# EAGLE design phone_charger (EAGLE 5.11)
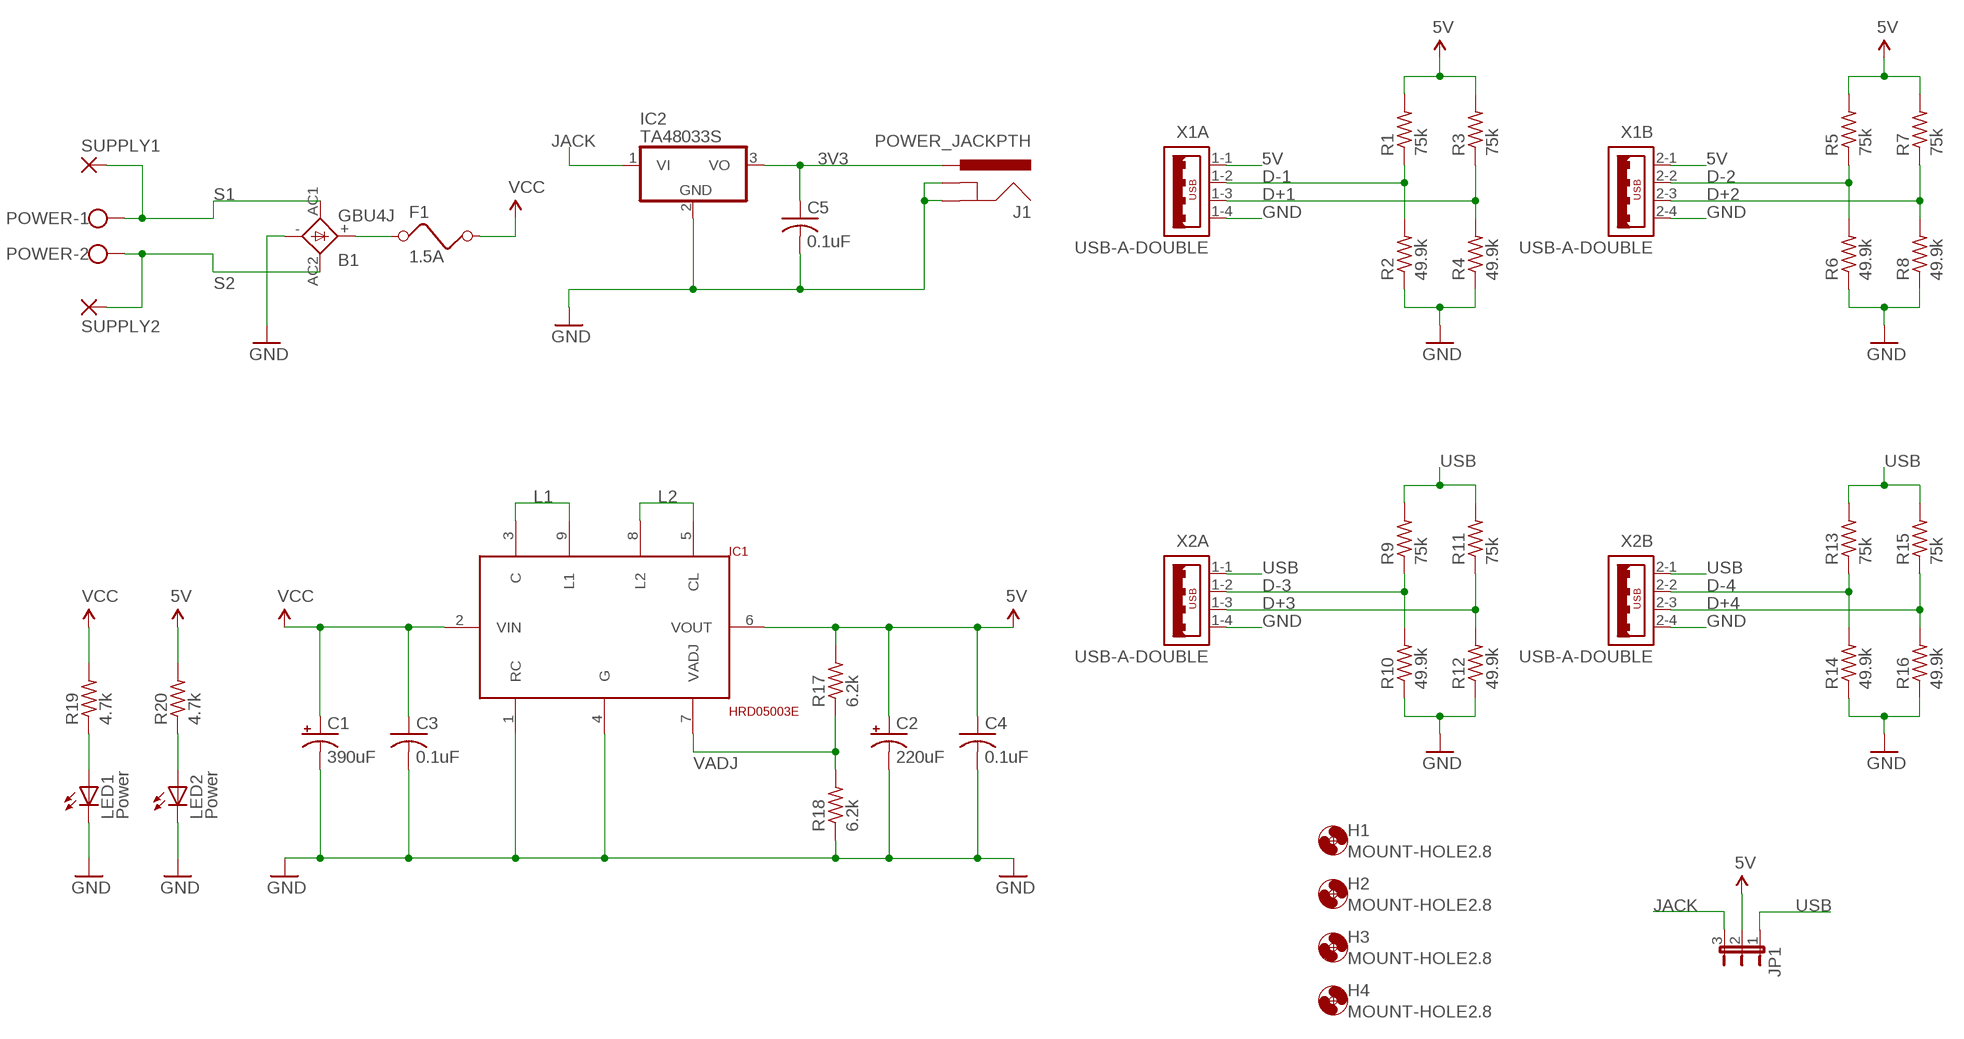
[diagram p0: schematic, sheet 1]

## Parts
B1  GBU4J  GBU4  [GBU4S]
C1  390uF  CPOL-USE3.5-8  [E3,5-8]
C2  220uF  CPOL-USE3.5-8  [E3,5-8]
C3  0.1uF  C-US025-030X050  [C025-030X050]
C4  0.1uF  C-US025-030X050  [C025-030X050]
C5  0.1uF  C-US025-030X050  [C025-030X050]
F1  1.5A  FUSE  [FUSE]
H1  MOUNT-HOLE2.8  [2,8]
H2  MOUNT-HOLE2.8  [2,8]
H3  MOUNT-HOLE2.8  [2,8]
H4  MOUNT-HOLE2.8  [2,8]
IC1  HRD05003E  [CONV-PACK]
IC2  TA48033S  788TV  [TO220V]
J1  POWER_JACKPTH  [POWER_JACK_PTH]
JP1  JP2E  [JP2]
LED1  Power  LED5MM  [LED5MM]
LED2  Power  LED5MM  [LED5MM]
POWER  W237-102  [W237-102]
R1  75k  R-US_0207/10  [0207/10]
R2  49.9k  R-US_0207/10  [0207/10]
R3  75k  R-US_0207/10  [0207/10]
R4  49.9k  R-US_0207/10  [0207/10]
R5  75k  R-US_0207/10  [0207/10]
R6  49.9k  R-US_0207/10  [0207/10]
R7  75k  R-US_0207/10  [0207/10]
R8  49.9k  R-US_0207/10  [0207/10]
R9  75k  R-US_0207/10  [0207/10]
R10  49.9k  R-US_0207/10  [0207/10]
R11  75k  R-US_0207/10  [0207/10]
R12  49.9k  R-US_0207/10  [0207/10]
R13  75k  R-US_0207/10  [0207/10]
R14  49.9k  R-US_0207/10  [0207/10]
R15  75k  R-US_0207/10  [0207/10]
R16  49.9k  R-US_0207/10  [0207/10]
R17  6.2k  R-US_0207/10  [0207/10]
R18  6.2k  R-US_0207/10  [0207/10]
R19  4.7k  R-US_0207/10  [0207/10]
R20  4.7k  R-US_0207/10  [0207/10]
SUPPLY1  3,81/1,4  [3,81/1,4]
SUPPLY2  3,81/1,4  [3,81/1,4]
X1  USB-A-DOUBLE  [USB-A-DOUBLE]
X2  USB-A-DOUBLE  [USB-A-DOUBLE]

## Nets
3V3: C5.1 IC2.3(VO) J1.PWR
5V: C2.+ C4.1 IC1.6(VOUT) JP1.2 R1.2 R3.2 R5.2 R7.2 R17.2 R20.2 X1.1-1 X1.2-1
D+1: R3.1 R4.2 X1.1-3
D+2: R7.1 R8.2 X1.2-3
D+3: R11.1 R12.2 X2.1-3
D+4: R15.1 R16.2 X2.2-3
D-1: R1.1 R2.2 X1.1-2
D-2: R5.1 R6.2 X1.2-2
D-3: R9.1 R10.2 X2.1-2
D-4: R13.1 R14.2 X2.2-2
GND: B1.- C1.- C2.- C3.2 C4.2 C5.2 IC1.1(RC) IC1.4(G) IC2.2(GND) J1.GND J1.GNDBREAK LED1.K(C) LED2.K(C) R2.1 R4.1 R6.1 R8.1 R10.1 R12.1 R14.1 R16.1 R18.1 X1.1-4 X1.2-4 X2.1-4 X2.2-4
JACK: IC2.1(VI) JP1.3
L1: IC1.3(C) IC1.9(L1)
L2: IC1.5(CL) IC1.8(L2)
N$1: LED1.A R19.1
N$2: LED2.A R20.1
N$3: B1.+ F1.1
S1: B1.AC1(AC2) POWER.1 SUPPLY1.1(P)
S2: B1.AC2(AC1) POWER.2 SUPPLY2.1(P)
USB: JP1.1 R9.2 R11.2 R13.2 R15.2 X2.1-1 X2.2-1
VADJ: IC1.7(VADJ) R17.1 R18.2
VCC: C1.+ C3.1 F1.2 IC1.2(VIN) R19.2

## Library data of the parts
B1 = rectifier:GBU4: GENERAL INSTRUMENT RECTIFIER
C1 C2 = rcl:CPOL-US: POLARIZED CAPACITOR, American symbol
C3-C5 = rcl:C-US: CAPACITOR, American symbol
F1 = special:FUSE: FUSE 5 x 20 mm
H1-H4 = holes:MOUNT-HOLE: MOUNTING HOLE with drill center marker
IC1 = tayken:HRD05003E
IC2 = linear:78*: Positive VOLTAGE REGULATOR Source: http://cache.national.com/ds/LM/LM78L05.pdf http://www.fairchildsemi.com/ds/LM/LM7805.pdf
J1 = SparkFun:POWER_JACK: Power Jack This is the standard 5.5mm barrel jack for power. The PTH is the most common, proven, reliable, footprint. All others are experimental. The Slot footprint only works if the mill layer is transmitted to the PCB fab house so be warned. Spark Fun Electronics SKU : PRT-00119. Mating wall wart : TOL-00298 (and others)
JP1 = jumper:JP2E: JUMPER
LED1 LED2 = SparkFun:LED: LEDs Standard schematic elements and footprints for 5mm, 3mm, 1206, and 0603 sized LEDs. 5mm - Spark Fun Electronics SKU : COM-00529 (and others)
POWER = con-wago-500:W237-102: WAGO SCREW CLAMP; MPN: 237-102; OC_FARNELL: unknown; OC_NEWARK: 70K9898
R1-R20 = resistor:R-US_: RESISTOR, American symbol
SUPPLY1 SUPPLY2 = wirepad:3,81/1,4: THROUGH-HOLE PAD
X1 X2 = tayken:USB-A-DOUBLE

## Board
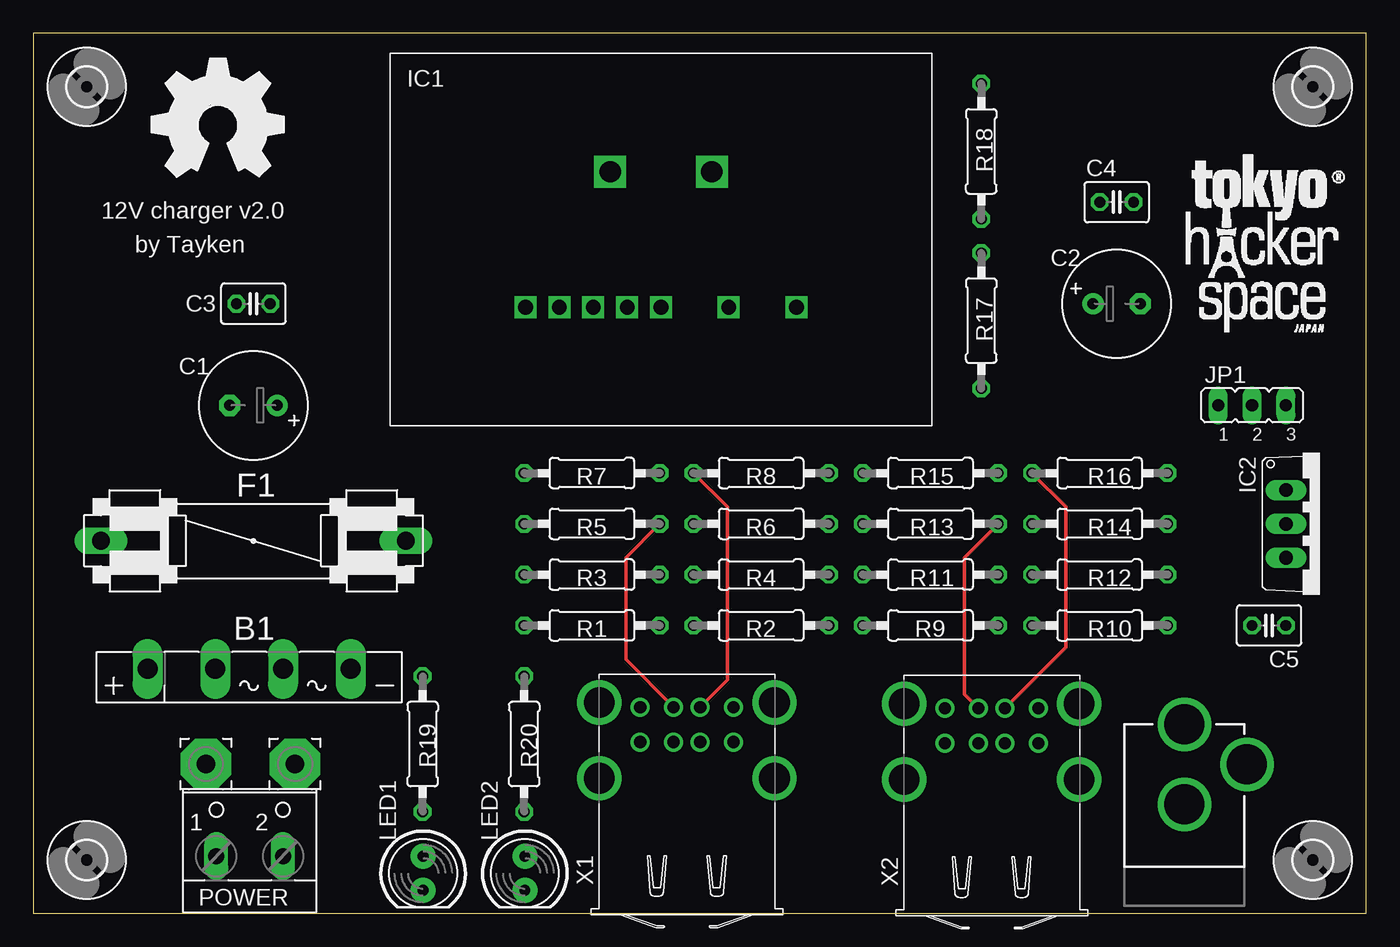
[diagram p1: board, top side]
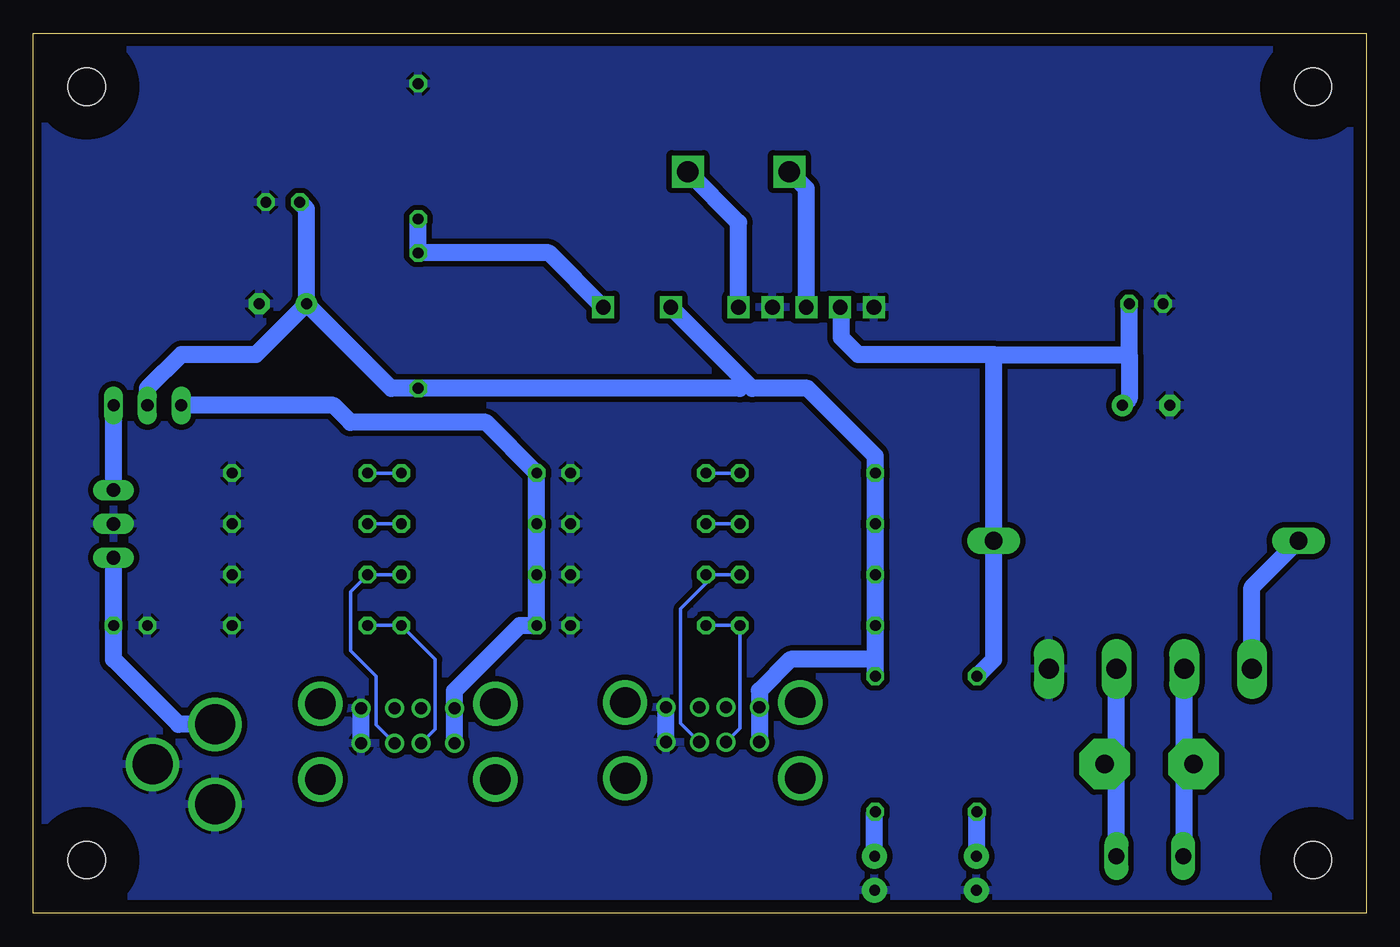
[diagram p2: board, bottom side, seen from below]

Size 100 x 66 mm. Coordinates in mm from the lower left corner, seen from the top.
Outline: 0,0 100,0 100,66 0,66 0,0
Copper layers (1*16): Top 0.035mm / dielectric 1.5mm / Bottom 0.035mm
Design rules "Fusion_eagle_rule_v1.1": minimum track width 6mil, minimum drill 12mil, track to track 6mil, track to pad 6mil, pad to pad 6mil, via to via 6mil, smd to smd 0mil, copper to edge 10mil, drill to drill 10mil, minimum pad ring 10mil, minimum via ring 6mil, stop-mask expansion 2mil, vias tented up to drill 100mil, thermal gap 10mil

### Footprints (pad centres in the part's own frame; a part is rotated, then mirrored left to right if it is on the bottom)
GBU4S = drill 1.499 long: + 7.62,0; - -7.62,0; AC1 2.54,0; AC2 -2.54,0
E3,5-8 = drill 0.813 pad 1.6 round: + -1.778,0 | drill 0.813 pad 1.6 octagon: - 1.778,0
C025-030X050 = drill 0.813 octagon: 1 -1.27,0; 2 1.27,0
FUSE = drill 1.321 long: 1 -11.43,0; 2 11.43,0
2,8 = hole 2.8: 0,0
CONV-PACK = drill 1.1 square: 1 -10.16,-5.08; 2 -7.62,-5.08; 3 -5.08,-5.08; 4 -2.54,-5.08; 5 0,-5.08; 6 5.08,-5.08; 7 10.16,-5.08 | drill 1.6 square: 8 3.81,5.08; 9 -3.81,5.08
TO220V = drill 1.016 long: 1 -2.54,-2.54; 2 0,-2.54; 3 2.54,-2.54
POWER_JACK_PTH = drill 2.997 round: GND 0,7.7; GNDBREAK 4.7,10.7; PWR 0,13.7
JP2 = drill 0.914 long: 1 -2.54,0; 2 0,0; 3 2.54,0
LED5MM = drill 0.813 pad 1.88 round: A -1.27,0; K 1.27,0
W237-102 = drill 1.194 long: 1 -2.5,-1.27; 2 2.5,-1.27
0207/10 = drill 0.813 octagon: 1 -5.08,0; 2 5.08,0
3,81/1,4 = drill 1.397 pad 3.81 octagon: 1 0,0
USB-A-DOUBLE = drill 0.92 pad 1.27 round: 1-1 1.44,3.5; 1-2 1.44,1; 1-3 1.44,-1; 1-4 1.44,-3.5; 2-1 4.06,3.5; 2-2 4.06,1; 2-3 4.06,-1; 2-4 4.06,-3.5 | drill 2.3 pad 3 round: M1 -1.27,6.57; M2 -1.27,-6.57; M3 4.41,6.57; M4 4.41,-6.57

### Placement (x,y rotation side)
B1  16.2,18.34 180 top
C1  16.51,38.1 180 top
C2  81.28,45.72 0 top
C3  16.51,45.72 180 top
C4  81.28,53.34 0 top
C5  92.71,21.59 180 top
F1  16.51,27.94 0 top
H1  4,4 0 top
H2  96,4 0 top
H3  96,62 0 top
H4  4,62 0 top
IC1  47.09,50.54 0 top
IC2  96.52,29.21 270 top
J1  86.36,0.48 0 top
JP1  91.44,38.1 0 top
LED1  29.25,3 270 top
LED2  36.88,3 270 top
POWER  16.23,5.56 0 top
R1  41.91,21.59 180 top
R2  54.61,21.59 180 top
R3  41.91,25.4 180 top
R4  54.61,25.4 180 top
R5  41.91,29.21 180 top
R6  54.61,29.21 180 top
R7  41.91,33.02 180 top
R8  54.61,33.02 180 top
R9  67.31,21.59 180 top
R10  80.01,21.59 180 top
R11  67.31,25.4 180 top
R12  80.01,25.4 180 top
R13  67.31,29.21 180 top
R14  80.01,29.21 180 top
R15  67.31,33.02 180 top
R16  80.01,33.02 180 top
R17  71.12,44.45 270 top
R18  71.12,57.15 270 top
R19  29.21,12.7 90 top
R20  36.83,12.7 90 top
SUPPLY1  12.95,11.2 0 top
SUPPLY2  19.63,11.2 0 top
U$4  [THS]  82.55,40.64 0 top
U$6  [OSHW_FILLX350_NOTEXT]  8.89,55.24 0 top
X1  49.03,11.4 90 top
X2  71.9,11.31 90 top

### Tracks (layer width: path | path; a pad name or v marks a point on that pad's centre or on a via)
3V3
  Bottom 1.27: J1.PWR 89.11,14.18 93.98,19.05 C5.1 IC2.3
5V
  Bottom 1.27: R20.2 36.83,19.05 | 36.83,19.05 R1.2 R3.2 R5.2 R7.2 36.83,34.29 41.91,39.37 46.08,39.37 46.53,39.83 | 46.53,39.83 IC1.6 | X1.1-1 X1.2-1 45.53,16.7 43.18,19.05 36.83,19.05 | JP1.2 91.44,39.37 88.9,41.91 83.31,41.91 C2.+ | C2.+ 79.5,52.83 C4.1 | 46.53,39.83 46.99,39.37 R17.2 73.15,39.37 C2.+
D+1
  Bottom 0.254: R3.1 R4.2 49.53,24.77 51.44,22.86 51.44,14.25 X1.1-3
D+2
  Top 0.254: R8.2 52.07,30.48 52.07,17.5 X1.2-3
  Bottom 0.254: R8.2 R7.1
D+3
  Bottom 0.254: R11.1 R12.2 76.2,24.13 76.2,19.68 74.3,17.78 74.3,14.15 X2.1-3
D+4
  Top 0.254: R16.2 77.47,30.48 77.47,19.95 X2.2-3
  Bottom 0.254: R16.2 R15.1
D-1
  Bottom 0.254: R2.2 R1.1 46.99,13.88 X1.1-2
D-2
  Top 0.254: R5.1 44.45,26.67 44.45,19.05 X1.2-2
  Bottom 0.254: R5.1 R6.2
D-3
  Bottom 0.254: R10.2 R9.1 69.85,19.05 69.85,13.8 X2.1-2
D-4
  Top 0.254: R13.1 69.85,26.67 69.85,16.43 X2.2-2
  Bottom 0.254: R13.1 R14.2
GND
  Bottom 1.27: X1.1-4 X1.2-4 | X2.1-4 X2.2-4
  pour Bottom (isolate 0.406): 1.27,64.77 1.27,1.27 99.06,1.27 99.06,64.77
JACK
  Bottom 1.27: IC2.1 JP1.3
L1
  Bottom 1.27: IC1.3 42.01,54.35 IC1.9
L2
  Bottom 1.27: IC1.5 47.09,51.81 IC1.8
N$1
  Bottom 1.27: LED1.A 29.21,4.27 R19.1
N$2
  Bottom 1.27: LED2.A 36.88,7.57 R20.1
N$3
  Bottom 1.27: B1.+ 8.58,24.44 F1.1
S1
  Bottom 0.254: 13.66,11.43 13.97,11.43
  Bottom 1.27: POWER.1 13.66,4.29 13.66,11.43 B1.AC1 | SUPPLY1.1 13.97,11.2 13.97,11.43
S2
  Bottom 1.27: POWER.2 18.74,11.2 | B1.AC2 18.74,11.43 18.74,11.2 | 18.74,11.2 SUPPLY2.1
USB
  Bottom 1.27: X2.1-1 X2.2-1 68.4,16.69 63.5,21.59 R9.2 R11.2 R13.2 R15.2 66.04,36.83 76.2,36.83 77.47,38.1 JP1.1
VADJ
  Bottom 1.27: R18.2 R17.1 61.32,49.53 IC1.7
VCC
  Bottom 1.27: IC1.2 39.37,45.36 39.37,43.18 38.1,41.91 27.94,41.91 | 27.94,41.91 17.78,41.91 | 17.78,41.91 C3.1 | C1.+ 17.78,38.61 17.78,41.91 | 27.94,41.91 F1.2 27.94,19.05 R19.2

### Text on the board
tPlace: 12V charger v2.0 | by Tayken